# Altium schematic sheet E-16 LVDS to HDMI.SchDoc: FRDM-IMX93
size 513 x 386 mm; DrawnBy: FORLINX; Organization: ORGANIZATION; Address1: ADDRESS 1; Address2: ADDRESS 2; Address3: ADDRESS 3; Address4: ADDRESS 4; Revision: -; ENG_APP_DATE: --/--/--; DSN_APP_DATE: --/--/--; CHK_APP_DATE: --/--/--; Classification: Public, Company Internal/Proprietary, Company Confidential,  Company Secret; Page Create Date: March  8, 1995; OrgName: NXP Semiconductor; FIUO: A; OrgAddr1: NO. 192 Liangjing Rd. Pudong New Area, ShangHai; Page Number: 16; PageTitle: LVDS to HDMI; Page Size: C; Page Count: 23; Designer: FORLINX; RevCode: B1; Approver: NXP SE; Doc: SCH-94611 PDF: SPF-94611; DsnPath: T:\FILES\Designs\Single Board Computers\i.MX93-FRDM\Design Files\SCH-94611_B1.DSN; SchematicName: FRDM-i.MX 93 Development Board; PageName: E-16 LVDS to HDMI; PageSize: C; TopSchematic: True
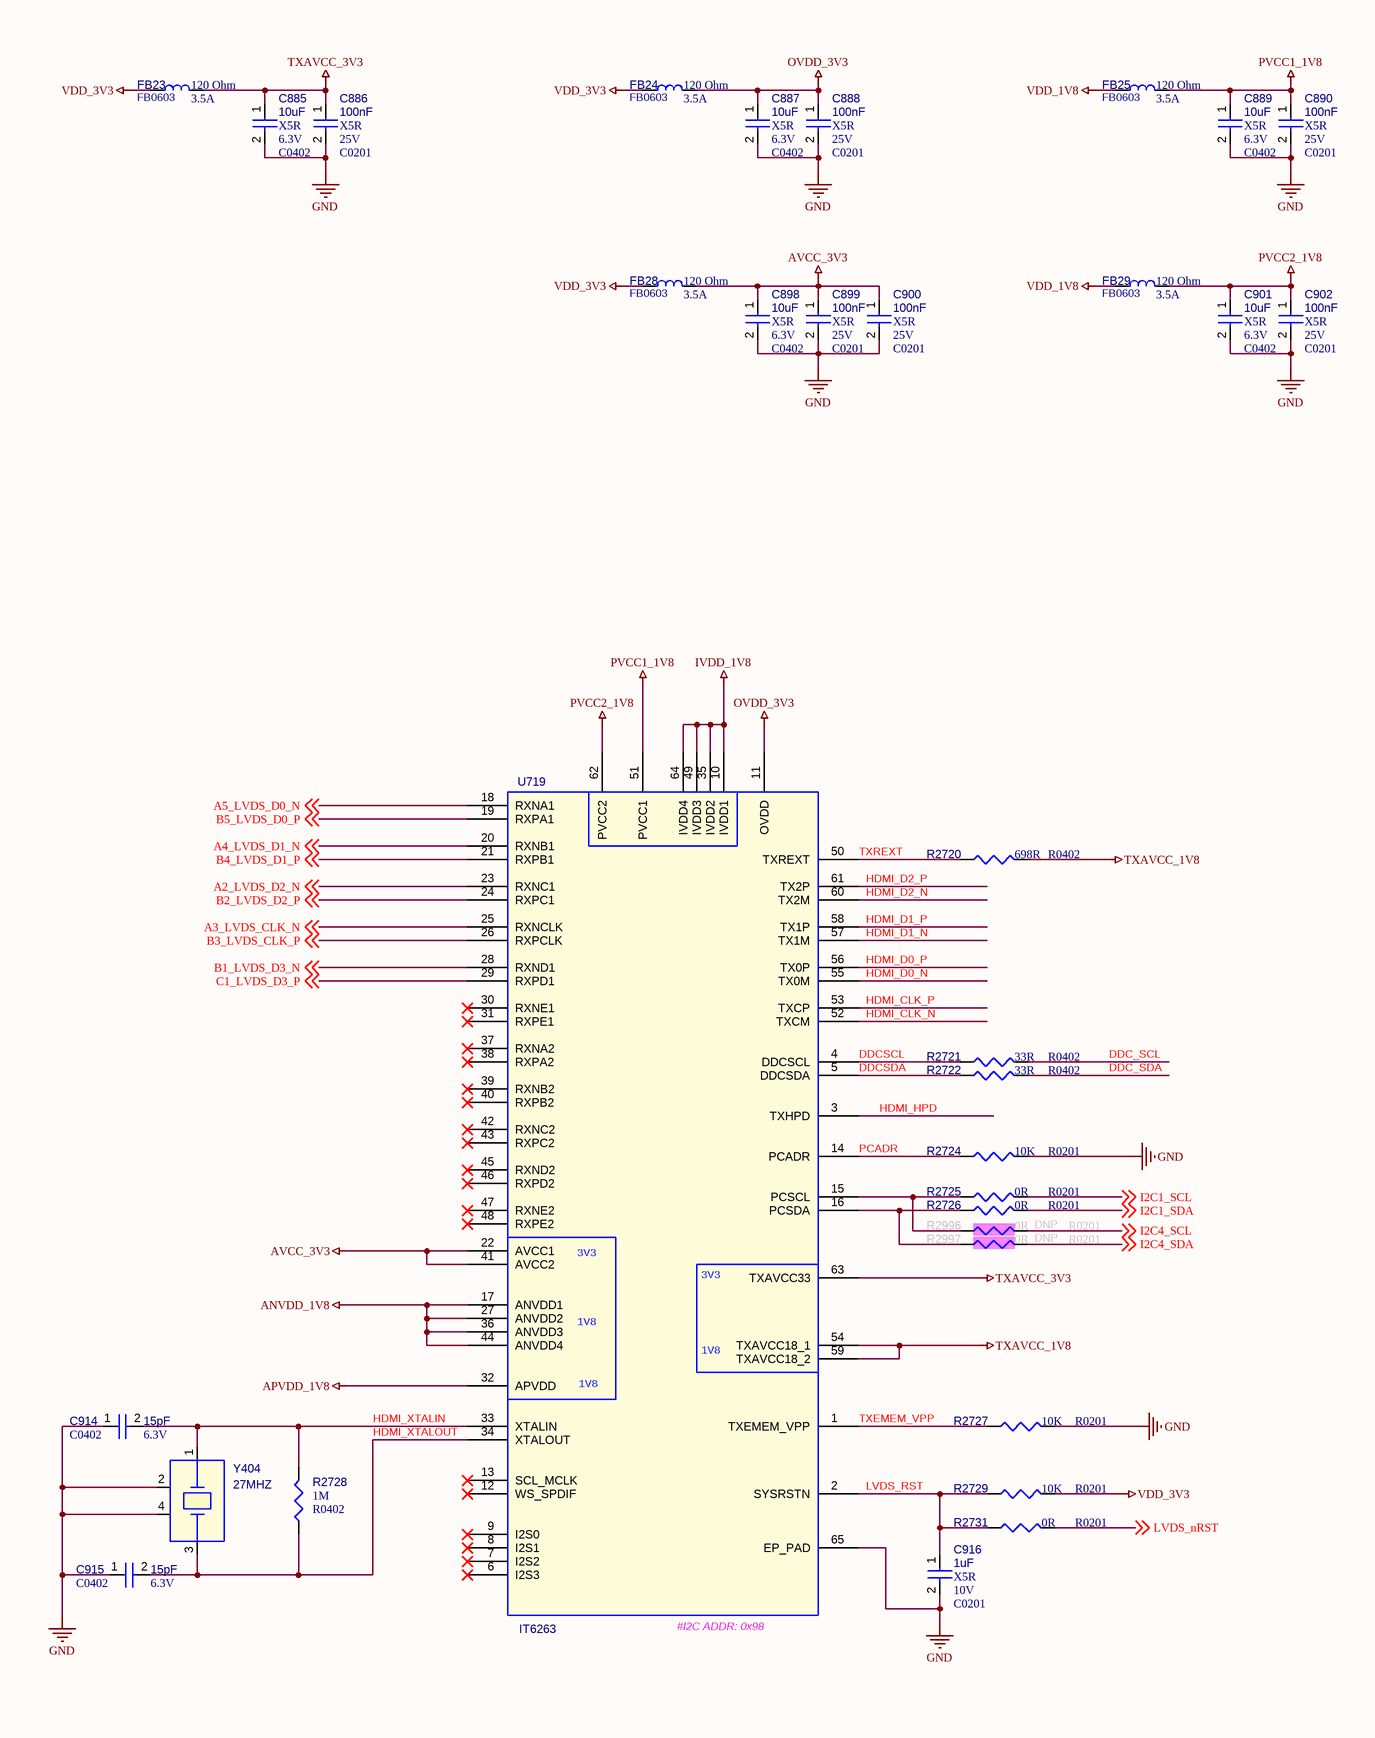
[diagram p0: E-16 LVDS to HDMI.SchDoc, left]
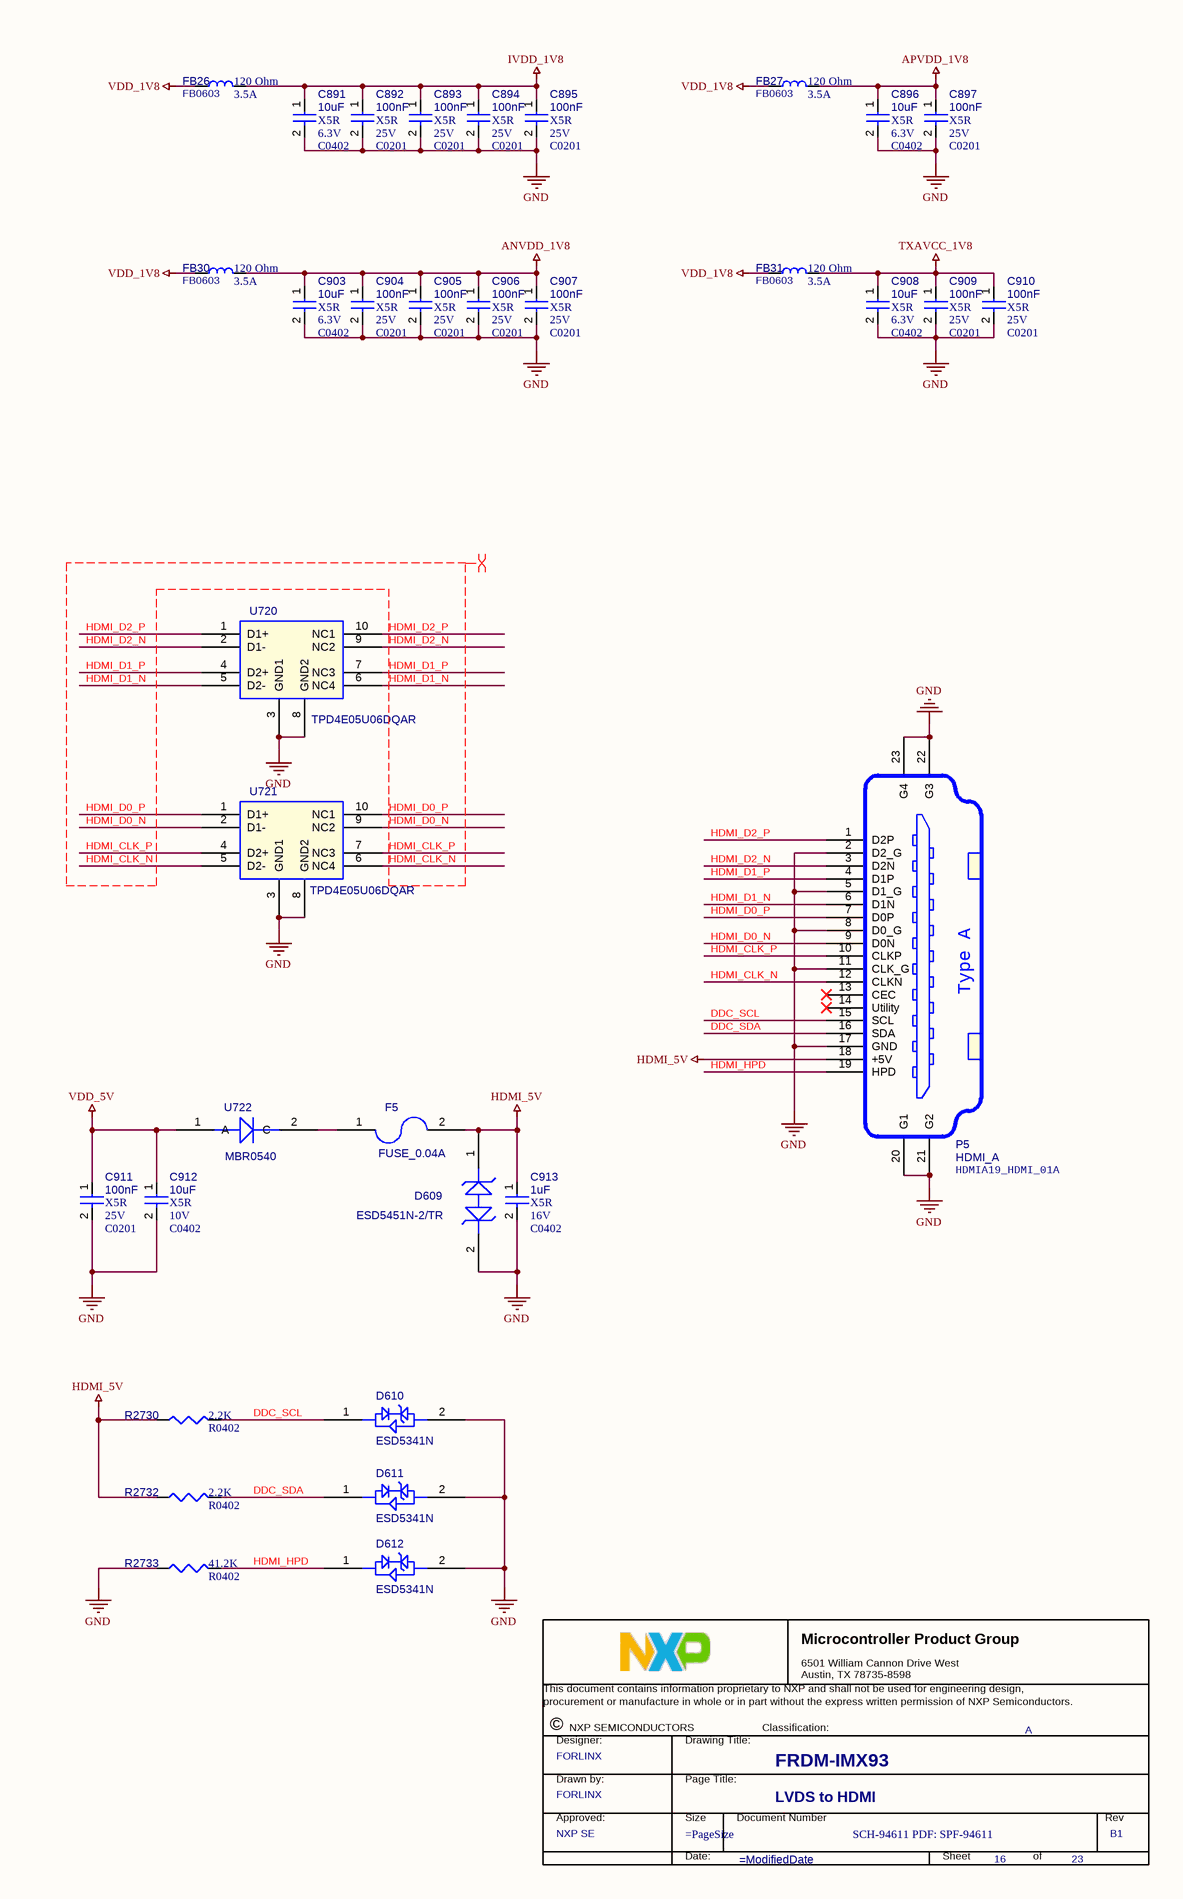
[diagram p1: E-16 LVDS to HDMI.SchDoc, right]

## Parts
*  Title: FRDM-IMX93  RevCode: B1  PageTitle: LVDS to HDMI  Page Number: 16  Page Count: 23  DrawnBy: FORLINX  Doc: SCH-94611 PDF: SPF-94611  Approver: NXP SE  FIUO: A  (graphical)
C885  10uF  Voltage: 6.3V  Dielectric: X5R  [C0402]
C886  100nF  Voltage: 25V  Dielectric: X5R  [C0201]
C887  10uF  Voltage: 6.3V  Dielectric: X5R  [C0402]
C888  100nF  Voltage: 25V  Dielectric: X5R  [C0201]
C889  10uF  Voltage: 6.3V  Dielectric: X5R  [C0402]
C890  100nF  Voltage: 25V  Dielectric: X5R  [C0201]
C891  10uF  Voltage: 6.3V  Dielectric: X5R  [C0402]
C892  100nF  Voltage: 25V  Dielectric: X5R  [C0201]
C893  100nF  Voltage: 25V  Dielectric: X5R  [C0201]
C894  100nF  Voltage: 25V  Dielectric: X5R  [C0201]
C895  100nF  Voltage: 25V  Dielectric: X5R  [C0201]
C896  10uF  Voltage: 6.3V  Dielectric: X5R  [C0402]
C897  100nF  Voltage: 25V  Dielectric: X5R  [C0201]
C898  10uF  Voltage: 6.3V  Dielectric: X5R  [C0402]
C899  100nF  Voltage: 25V  Dielectric: X5R  [C0201]
C900  100nF  Voltage: 25V  Dielectric: X5R  [C0201]
C901  10uF  Voltage: 6.3V  Dielectric: X5R  [C0402]
C902  100nF  Voltage: 25V  Dielectric: X5R  [C0201]
C903  10uF  Voltage: 6.3V  Dielectric: X5R  [C0402]
C904  100nF  Voltage: 25V  Dielectric: X5R  [C0201]
C905  100nF  Voltage: 25V  Dielectric: X5R  [C0201]
C906  100nF  Voltage: 25V  Dielectric: X5R  [C0201]
C907  100nF  Voltage: 25V  Dielectric: X5R  [C0201]
C908  10uF  Voltage: 6.3V  Dielectric: X5R  [C0402]
C909  100nF  Voltage: 25V  Dielectric: X5R  [C0201]
C910  100nF  Voltage: 25V  Dielectric: X5R  [C0201]
C911  100nF  Voltage: 25V  Dielectric: X5R  [C0201]
C912  10uF  Voltage: 10V  Dielectric: X5R  [C0402]
C913  1uF  Voltage: 16V  Dielectric: X5R  [C0402]
C914  15pF  Voltage: 6.3V  [C0402]
C915  15pF  Voltage: 6.3V  [C0402]
C916  1uF  Voltage: 10V  Dielectric: X5R  [C0201]
D609  ESD5451N-2/TR  [0402TVS]
D610  ESD5341N  [0402TVS]
D611  ESD5341N  [0402TVS]
D612  ESD5341N  [0402TVS]
F5  FUSE_0.04A  [F0603]
FB23  120 Ohm  electric current: 3.5A  [FB0603]
FB24  120 Ohm  electric current: 3.5A  [FB0603]
FB25  120 Ohm  electric current: 3.5A  [FB0603]
FB26  120 Ohm  electric current: 3.5A  [FB0603]
FB27  120 Ohm  electric current: 3.5A  [FB0603]
FB28  120 Ohm  electric current: 3.5A  [FB0603]
FB29  120 Ohm  electric current: 3.5A  [FB0603]
FB30  120 Ohm  electric current: 3.5A  [FB0603]
FB31  120 Ohm  electric current: 3.5A  [FB0603]
P5  HDMI_A  [HDMIA19_HDMI_01A]
R2720  698R  [R0402]
R2721  33R  [R0402]
R2722  33R  [R0402]
R2724  10K  [R0201]
R2725  0R  [R0201]
R2726  0R  [R0201]
R2727  10K  [R0201]
R2728  1M  [R0402]
R2729  10K  [R0201]
R2730  2.2K  [R0402]
R2731  0R  [R0201]
R2732  2.2K  [R0402]
R2733  41.2K  [R0402]
R2996  0R  ASSY_OPT: DNP  [R0201]
R2997  0R  ASSY_OPT: DNP  [R0201]
U719  IT6263  [qfn64_0p5_9x9_157ep]
U720  TPD4E05U06DQAR  [USON-10]
U721  TPD4E05U06DQAR  [USON-10]
U722  MBR0540  [SOD_123]
Y404  27MHZ  [xtlosc4_3p2x2p5mm_sm]

## Nets
ANVDD_1V8: C903.1 C904.1 C905.1 C906.1 C907.1 FB30.2 U719.17(ANVDD1) U719.27(ANVDD2) U719.36(ANVDD3) U719.44(ANVDD4)
APVDD_1V8: C896.1 C897.1 FB27.2 U719.32(APVDD)
AVCC_3V3: C898.1 C899.1 C900.1 FB28.2 U719.22(AVCC1) U719.41(AVCC2)
GND: C885.2 C886.2 C887.2 C888.2 C889.2 C890.2 C891.2 C892.2 C893.2 C894.2 C895.2 C896.2 C897.2 C898.2 C899.2 C900.2 C901.2 C902.2 C903.2 C904.2 C905.2 C906.2 C907.2 C908.2 C909.2 C910.2 C911.2 C912.2 C913.2 C914.1 C915.1 C916.2 D609.2 D610.2 D611.2 D612.2 P5.2(D2_G) P5.5(D1_G) P5.8(D0_G) P5.11(CLK_G) P5.17(GND) P5.20(G1) P5.21(G2) P5.22(G3) P5.23(G4) R2724.2 R2727.2 R2733.1 U719.65(EP_PAD) U720.3(GND1) U720.8(GND2) U721.3(GND1) U721.8(GND2) Y404.2 Y404.4
HDMI_5V: C913.1 D609.1 F5.2 P5.18(+5V) R2730.1 R2732.1
IVDD_1V8: C891.1 C892.1 C893.1 C894.1 C895.1 FB26.2 U719.10(IVDD1) U719.35(IVDD2) U719.49(IVDD3) U719.64(IVDD4)
OVDD_3V3: C887.1 C888.1 FB24.2 U719.11(OVDD)
PVCC1_1V8: C889.1 C890.1 FB25.2 U719.51(PVCC1)
PVCC2_1V8: C901.1 C902.1 FB29.2 U719.62(PVCC2)
TXAVCC_1V8: C908.1 C909.1 C910.1 FB31.2 R2720.2 U719.54(TXAVCC18_1) U719.59(TXAVCC18_2)
TXAVCC_3V3: C885.1 C886.1 FB23.2 U719.63(TXAVCC33)
VDD_1V8: FB25.1 FB26.1 FB27.1 FB29.1 FB30.1 FB31.1
VDD_3V3: FB23.1 FB24.1 FB28.1 R2729.2
VDD_5V: C911.1 C912.1 U722.1(A)
A2_LVDS_D2_N: U719.23(RXNC1) ; off-sheet A2_LVDS_D2_N
A3_LVDS_CLK_N: U719.25(RXNCLK) ; off-sheet A3_LVDS_CLK_N
A4_LVDS_D1_N: U719.20(RXNB1) ; off-sheet A4_LVDS_D1_N
A5_LVDS_D0_N: U719.18(RXNA1) ; off-sheet A5_LVDS_D0_N
B1_LVDS_D3_N: U719.28(RXND1) ; off-sheet B1_LVDS_D3_N
B2_LVDS_D2_P: U719.24(RXPC1) ; off-sheet B2_LVDS_D2_P
B3_LVDS_CLK_P: U719.26(RXPCLK) ; off-sheet B3_LVDS_CLK_P
B4_LVDS_D1_P: U719.21(RXPB1) ; off-sheet B4_LVDS_D1_P
B5_LVDS_D0_P: U719.19(RXPA1) ; off-sheet B5_LVDS_D0_P
C1_LVDS_D3_P: U719.29(RXPD1) ; off-sheet C1_LVDS_D3_P
DDC_SCL: D610.1 P5.15(SCL) R2721.2 R2730.2
DDC_SDA: D611.1 P5.16(SDA) R2722.2 R2732.2
DDCSCL: R2721.1 U719.4(DDCSCL)
DDCSDA: R2722.1 U719.5(DDCSDA)
HDMI_CLK_N: P5.12(CLKN) U719.52(TXCM) U721.5(D2-) U721.6(NC4)
HDMI_CLK_P: P5.10(CLKP) U719.53(TXCP) U721.4(D2+) U721.7(NC3)
HDMI_D0_N: P5.9(D0N) U719.55(TX0M) U721.2(D1-) U721.9(NC2)
HDMI_D0_P: P5.7(D0P) U719.56(TX0P) U721.1(D1+) U721.10(NC1)
HDMI_D1_N: P5.6(D1N) U719.57(TX1M) U720.5(D2-) U720.6(NC4)
HDMI_D1_P: P5.4(D1P) U719.58(TX1P) U720.4(D2+) U720.7(NC3)
HDMI_D2_N: P5.3(D2N) U719.60(TX2M) U720.2(D1-) U720.9(NC2)
HDMI_D2_P: P5.1(D2P) U719.61(TX2P) U720.1(D1+) U720.10(NC1)
HDMI_HPD: D612.1 P5.19(HPD) R2733.2 U719.3(TXHPD)
HDMI_XTALIN: C914.2 R2728.2 U719.33(XTALIN) Y404.1
HDMI_XTALOUT: C915.2 R2728.1 U719.34(XTALOUT) Y404.3
I2C1_SCL: R2725.2 ; off-sheet I2C1_SCL
I2C1_SDA: R2726.2 ; off-sheet I2C1_SDA
I2C4_SCL: R2996.2 ; off-sheet I2C4_SCL
I2C4_SDA: R2997.2 ; off-sheet I2C4_SDA
LVDS_nRST: R2731.2 ; off-sheet LVDS_nRST
LVDS_RST: C916.1 R2729.1 R2731.1 U719.2(SYSRSTN)
PCADR: R2724.1 U719.14(PCADR)
TXEMEM_VPP: R2727.1 U719.1(TXEMEM_VPP)
TXREXT: R2720.1 U719.50(TXREXT)
NetF5_1: F5.1 U722.2(C)
NetR2725_1: R2725.1 R2996.1 U719.15(PCSCL)
NetR2726_1: R2726.1 R2997.1 U719.16(PCSDA)

Not connected (* = marked no-connect by the designer): P5 13(CEC)* 14(Utility)*; U719 6(I2S3)* 7(I2S2)* 8(I2S1)* 9(I2S0)* 12(WS_SPDIF)* 13(SCL_MCLK)* 30(RXNE1)* 31(RXPE1)* 37(RXNA2)* 38(RXPA2)* 39(RXNB2)* 40(RXPB2)* 42(RXNC2)* 43(RXPC2)* 45(RXND2)* 46(RXPD2)* 47(RXNE2)* 48(RXPE2)*

## Layout directives
differential pair: HDMI_CLK_N, HDMI_CLK_P, HDMI_D0_N, HDMI_D0_P, HDMI_D1_N, HDMI_D1_P, HDMI_D2_N, HDMI_D2_P

## Notes on the sheet
- (near U719) #I2C ADDR: 0x98
- DWG. NO.
- REV.
- SHT.
- REVISION
- DESCRIPTION
- DATE
- APPROVED
- ENG:
- APPROVALS
- quilter.ai <http://quilter.ai>
- DSN:
- CHK:
- REFERENCE DOCUMENTS
- TITLE
- PROJECT
- BOM:
- FAB DWG:
- PCB DWG:
- ASSY DWG:
- SIZE
- FILE NAME
- C
- DWG NO.
- SHEET
- OF
- REV
- (in symbol HDMI_A) Type A
- (in symbol IT6263) 3V3; 1V8
- (in symbol TitleBlock_MCPG) Microcontroller Product Group; 6501 William Cannon Drive West / Austin, TX 78735-8598; This document contains information proprietary to NXP and shall not be used for engineering design,; procurement or manufacture in whole or in part without the express written permission of NXP Semiconductors.; ©; NXP SEMICONDUCTORS; Classification:; Designer:; Drawing Title:; Drawn by:; Page Title:; Approved:; Size; Document Number; Rev; Date:; Sheet; of

## Library data of the parts
* = TitleBlock_MCPG: Classification: Public, Company Internal/Proprietary, Company Confidential,  Company Secret; OrgAddr1: NO. 192 Liangjing Rd. Pudong New Area, ShangHai; OrgName: NXP Semiconductor; Page Size: =PageSize; Page Create Date: March  8, 1995; Designer: FORLINX; Page Modify Date: =ModifiedDate
C885 = CAP NP: 0402,10uF,6.3V,+/-20%,X5R; Part Reference: C885; Manufacturer PN: 0402X104K6R3NT; Manufacturer: FH(·ç»ª); MFG_NAME01: FENGHUA; Tolerance: ¡À10%; Priority: A; RK PN: 902004347; MFG_PN01: 0402X106M6R3NT; PCB Footprint: C0402; Value: 10uF; Created by: JJJ; Part Type: Ò»°ãÓÃÆ¬×´ÌÕ´ÉµçÈÝ
C886 = CAP NP: 0201,100nF,25V,+/-10%,X5R; Part Reference: C886; Manufacturer: FH(·ç»ª); Manufacturer PN: 0402X104K6R3NT; MFG_NAME01: FENGHUA; RK PN: 902004347; Priority: A; Tolerance: ¡À10%; MFG_PN01: 0201X104K250NT; PCB Footprint: C0201; Value: 100nF; Part Type: Ò»°ãÓÃÆ¬×´ÌÕ´ÉµçÈÝ; Created by: JJJ
C887 = CAP NP: 0402,10uF,6.3V,+/-20%,X5R; Part Reference: C887; Manufacturer PN: 0402X104K6R3NT; Manufacturer: FH(·ç»ª); MFG_NAME01: FENGHUA; Tolerance: ¡À10%; Priority: A; RK PN: 902004347; MFG_PN01: 0402X106M6R3NT; PCB Footprint: C0402; Value: 10uF; Created by: JJJ; Part Type: Ò»°ãÓÃÆ¬×´ÌÕ´ÉµçÈÝ
C888 = CAP NP: 0201,100nF,25V,+/-10%,X5R; Part Reference: C888; Manufacturer: FH(·ç»ª); Manufacturer PN: 0402X104K6R3NT; MFG_NAME01: FENGHUA; RK PN: 902004347; Priority: A; Tolerance: ¡À10%; MFG_PN01: 0201X104K250NT; PCB Footprint: C0201; Value: 100nF; Part Type: Ò»°ãÓÃÆ¬×´ÌÕ´ÉµçÈÝ; Created by: JJJ
C889 = CAP NP: 0402,10uF,6.3V,+/-20%,X5R; Part Reference: C889; Manufacturer PN: 0402X104K6R3NT; Manufacturer: FH(·ç»ª); MFG_NAME01: FENGHUA; Tolerance: ¡À10%; Priority: A; RK PN: 902004347; MFG_PN01: 0402X106M6R3NT; PCB Footprint: C0402; Value: 10uF; Created by: JJJ; Part Type: Ò»°ãÓÃÆ¬×´ÌÕ´ÉµçÈÝ
C890 = CAP NP: 0201,100nF,25V,+/-10%,X5R; Part Reference: C890; Manufacturer: FH(·ç»ª); Manufacturer PN: 0402X104K6R3NT; MFG_NAME01: FENGHUA; RK PN: 902004347; Priority: A; Tolerance: ¡À10%; MFG_PN01: 0201X104K250NT; PCB Footprint: C0201; Value: 100nF; Part Type: Ò»°ãÓÃÆ¬×´ÌÕ´ÉµçÈÝ; Created by: JJJ
C891 = CAP NP: 0402,10uF,6.3V,+/-20%,X5R; Part Reference: C891; Manufacturer PN: 0402X104K6R3NT; Manufacturer: FH(·ç»ª); MFG_NAME01: FENGHUA; Tolerance: ¡À10%; Priority: A; RK PN: 902004347; MFG_PN01: 0402X106M6R3NT; PCB Footprint: C0402; Value: 10uF; Created by: JJJ; Part Type: Ò»°ãÓÃÆ¬×´ÌÕ´ÉµçÈÝ
C892 = CAP NP: 0201,100nF,25V,+/-10%,X5R; Part Reference: C892; Manufacturer: FH(·ç»ª); Manufacturer PN: 0402X104K6R3NT; MFG_NAME01: FENGHUA; RK PN: 902004347; Priority: A; Tolerance: ¡À10%; MFG_PN01: 0201X104K250NT; PCB Footprint: C0201; Value: 100nF; Part Type: Ò»°ãÓÃÆ¬×´ÌÕ´ÉµçÈÝ; Created by: JJJ
C893 = CAP NP: 0201,100nF,25V,+/-10%,X5R; Part Reference: C893; Manufacturer PN: 0402X104K6R3NT; Manufacturer: FH(·ç»ª); MFG_NAME01: FENGHUA; Tolerance: ¡À10%; Priority: A; RK PN: 902004347; MFG_PN01: 0201X104K250NT; PCB Footprint: C0201; Value: 100nF; Created by: JJJ; Part Type: Ò»°ãÓÃÆ¬×´ÌÕ´ÉµçÈÝ
C894 = CAP NP: 0201,100nF,25V,+/-10%,X5R; Part Reference: C894; Manufacturer PN: 0402X104K6R3NT; Manufacturer: FH(·ç»ª); MFG_NAME01: FENGHUA; Tolerance: ¡À10%; Priority: A; RK PN: 902004347; MFG_PN01: 0201X104K250NT; PCB Footprint: C0201; Value: 100nF; Created by: JJJ; Part Type: Ò»°ãÓÃÆ¬×´ÌÕ´ÉµçÈÝ
C895 = CAP NP: 0201,100nF,25V,+/-10%,X5R; Part Reference: C895; Manufacturer: FH(·ç»ª); Manufacturer PN: 0402X104K6R3NT; MFG_NAME01: FENGHUA; RK PN: 902004347; Priority: A; Tolerance: ¡À10%; MFG_PN01: 0201X104K250NT; PCB Footprint: C0201; Value: 100nF; Part Type: Ò»°ãÓÃÆ¬×´ÌÕ´ÉµçÈÝ; Created by: JJJ
C896 = CAP NP: 0402,10uF,6.3V,+/-20%,X5R; Part Reference: C896; Manufacturer PN: 0402X104K6R3NT; Manufacturer: FH(·ç»ª); MFG_NAME01: FENGHUA; Tolerance: ¡À10%; Priority: A; RK PN: 902004347; MFG_PN01: 0402X106M6R3NT; PCB Footprint: C0402; Value: 10uF; Created by: JJJ; Part Type: Ò»°ãÓÃÆ¬×´ÌÕ´ÉµçÈÝ
C897 = CAP NP: 0201,100nF,25V,+/-10%,X5R; Part Reference: C897; Manufacturer PN: 0402X104K6R3NT; Manufacturer: FH(·ç»ª); MFG_NAME01: FENGHUA; Tolerance: ¡À10%; Priority: A; RK PN: 902004347; MFG_PN01: 0201X104K250NT; PCB Footprint: C0201; Value: 100nF; Created by: JJJ; Part Type: Ò»°ãÓÃÆ¬×´ÌÕ´ÉµçÈÝ
C898 = CAP NP: 0402,10uF,6.3V,+/-20%,X5R; Part Reference: C898; Manufacturer: FH(·ç»ª); Manufacturer PN: 0402X104K6R3NT; MFG_NAME01: FENGHUA; RK PN: 902004347; Priority: A; Tolerance: ¡À10%; MFG_PN01: 0402X106M6R3NT; PCB Footprint: C0402; Value: 10uF; Part Type: Ò»°ãÓÃÆ¬×´ÌÕ´ÉµçÈÝ; Created by: JJJ
C899 = CAP NP: 0201,100nF,25V,+/-10%,X5R; Part Reference: C899; Manufacturer PN: 0402X104K6R3NT; Manufacturer: FH(·ç»ª); MFG_NAME01: FENGHUA; Tolerance: ¡À10%; Priority: A; RK PN: 902004347; MFG_PN01: 0201X104K250NT; PCB Footprint: C0201; Value: 100nF; Created by: JJJ; Part Type: Ò»°ãÓÃÆ¬×´ÌÕ´ÉµçÈÝ
C900 = CAP NP: 0201,100nF,25V,+/-10%,X5R; Part Reference: C900; Manufacturer PN: 0402X104K6R3NT; Manufacturer: FH(·ç»ª); MFG_NAME01: FENGHUA; Tolerance: ¡À10%; Priority: A; RK PN: 902004347; MFG_PN01: 0201X104K250NT; PCB Footprint: C0201; Value: 100nF; Created by: JJJ; Part Type: Ò»°ãÓÃÆ¬×´ÌÕ´ÉµçÈÝ
C901 = CAP NP: 0402,10uF,6.3V,+/-20%,X5R; Part Reference: C901; Manufacturer: FH(·ç»ª); Manufacturer PN: 0402X104K6R3NT; MFG_NAME01: FENGHUA; RK PN: 902004347; Priority: A; Tolerance: ¡À10%; MFG_PN01: 0402X106M6R3NT; PCB Footprint: C0402; Value: 10uF; Part Type: Ò»°ãÓÃÆ¬×´ÌÕ´ÉµçÈÝ; Created by: JJJ
C902 = CAP NP: 0201,100nF,25V,+/-10%,X5R; Part Reference: C902; Manufacturer PN: 0402X104K6R3NT; Manufacturer: FH(·ç»ª); MFG_NAME01: FENGHUA; Tolerance: ¡À10%; Priority: A; RK PN: 902004347; MFG_PN01: 0201X104K250NT; PCB Footprint: C0201; Value: 100nF; Created by: JJJ; Part Type: Ò»°ãÓÃÆ¬×´ÌÕ´ÉµçÈÝ
C903 = CAP NP: 0402,10uF,6.3V,+/-20%,X5R; Part Reference: C903; Manufacturer PN: 0402X104K6R3NT; Manufacturer: FH(·ç»ª); MFG_NAME01: FENGHUA; Tolerance: ¡À10%; Priority: A; RK PN: 902004347; MFG_PN01: 0402X106M6R3NT; PCB Footprint: C0402; Value: 10uF; Created by: JJJ; Part Type: Ò»°ãÓÃÆ¬×´ÌÕ´ÉµçÈÝ
C904 = CAP NP: 0201,100nF,25V,+/-10%,X5R; Part Reference: C904; Manufacturer: FH(·ç»ª); Manufacturer PN: 0402X104K6R3NT; MFG_NAME01: FENGHUA; RK PN: 902004347; Priority: A; Tolerance: ¡À10%; MFG_PN01: 0201X104K250NT; PCB Footprint: C0201; Value: 100nF; Part Type: Ò»°ãÓÃÆ¬×´ÌÕ´ÉµçÈÝ; Created by: JJJ
C905 = CAP NP: 0201,100nF,25V,+/-10%,X5R; Part Reference: C905; Manufacturer PN: 0402X104K6R3NT; Manufacturer: FH(·ç»ª); MFG_NAME01: FENGHUA; Tolerance: ¡À10%; Priority: A; RK PN: 902004347; MFG_PN01: 0201X104K250NT; PCB Footprint: C0201; Value: 100nF; Created by: JJJ; Part Type: Ò»°ãÓÃÆ¬×´ÌÕ´ÉµçÈÝ
C906 = CAP NP: 0201,100nF,25V,+/-10%,X5R; Part Reference: C906; Manufacturer PN: 0402X104K6R3NT; Manufacturer: FH(·ç»ª); MFG_NAME01: FENGHUA; Tolerance: ¡À10%; Priority: A; RK PN: 902004347; MFG_PN01: 0201X104K250NT; PCB Footprint: C0201; Value: 100nF; Created by: JJJ; Part Type: Ò»°ãÓÃÆ¬×´ÌÕ´ÉµçÈÝ
C907 = CAP NP: 0201,100nF,25V,+/-10%,X5R; Part Reference: C907; Manufacturer: FH(·ç»ª); Manufacturer PN: 0402X104K6R3NT; MFG_NAME01: FENGHUA; RK PN: 902004347; Priority: A; Tolerance: ¡À10%; MFG_PN01: 0201X104K250NT; PCB Footprint: C0201; Value: 100nF; Part Type: Ò»°ãÓÃÆ¬×´ÌÕ´ÉµçÈÝ; Created by: JJJ
C908 = CAP NP: 0402,10uF,6.3V,+/-20%,X5R; Part Reference: C908; Manufacturer PN: 0402X104K6R3NT; Manufacturer: FH(·ç»ª); MFG_NAME01: FENGHUA; Tolerance: ¡À10%; Priority: A; RK PN: 902004347; MFG_PN01: 0402X106M6R3NT; PCB Footprint: C0402; Value: 10uF; Created by: JJJ; Part Type: Ò»°ãÓÃÆ¬×´ÌÕ´ÉµçÈÝ
C909 = CAP NP: 0201,100nF,25V,+/-10%,X5R; Part Reference: C909; Manufacturer: FH(·ç»ª); Manufacturer PN: 0402X104K6R3NT; MFG_NAME01: FENGHUA; RK PN: 902004347; Priority: A; Tolerance: ¡À10%; MFG_PN01: 0201X104K250NT; PCB Footprint: C0201; Value: 100nF; Part Type: Ò»°ãÓÃÆ¬×´ÌÕ´ÉµçÈÝ; Created by: JJJ
C910 = CAP NP: 0201,100nF,25V,+/-10%,X5R; Part Reference: C910; Manufacturer: FH(·ç»ª); Manufacturer PN: 0402X104K6R3NT; MFG_NAME01: FENGHUA; RK PN: 902004347; Priority: A; Tolerance: ¡À10%; MFG_PN01: 0201X104K250NT; PCB Footprint: C0201; Value: 100nF; Part Type: Ò»°ãÓÃÆ¬×´ÌÕ´ÉµçÈÝ; Created by: JJJ
C911 = CAP NP: 0201,100nF,25V,+/-10%,X5R; Part Reference: C911; Manufacturer PN: 0402X104K6R3NT; Manufacturer: FH(·ç»ª); MFG_NAME01: FENGHUA; Tolerance: ¡À10%; Priority: A; RK PN: 902004347; MFG_PN01: 0201X104K250NT; PCB Footprint: C0201; Value: 100nF; Created by: JJJ; Part Type: Ò»°ãÓÃÆ¬×´ÌÕ´ÉµçÈÝ
C912 = CAP NP: 0402,10uF,6.3V,+/-20%,X5R; Part Reference: C912; Manufacturer PN: 0402X104K6R3NT; Manufacturer: FH(·ç»ª); MFG_NAME01: FENGHUA; Tolerance: ¡À10%; Priority: A; RK PN: 902004347; MFG_PN01: 0402X106M6R3NT; PCB Footprint: C0402; Value: 10uF; Created by: JJJ; Part Type: Ò»°ãÓÃÆ¬×´ÌÕ´ÉµçÈÝ
C913 = CAP NP: 0402,1uF,16V,+/-10%,X5R; Part Reference: C913; Manufacturer: FH(·ç»ª); Manufacturer PN: 0402X104K6R3NT; MFG_NAME01: SAMSUNG; RK PN: 902004347; Priority: A; Tolerance: ¡À10%; MFG_PN01: CL05A105KO5NNNC; PCB Footprint: C0402; Value: 1uF; Part Type: Ò»°ãÓÃÆ¬×´ÌÕ´ÉµçÈÝ; Created by: JJJ
C914 = CAP NP: 0402,15pF,50V,+/-5%,NPO; Part Reference: C914; Manufacturer: FH(·ç»ª); Manufacturer PN: 0402X104K6R3NT; Dielectric: X5R; MFG_NAME01: FENGHUA; RK PN: 902004347; Priority: A; Tolerance: ¡À10%; MFG_PN01: 0402B102K500NT; PCB Footprint: C0402; Value: 15pF; Part Type: Ò»°ãÓÃÆ¬×´ÌÕ´ÉµçÈÝ; Created by: JJJ
C915 = CAP NP: 0402,15pF,50V,+/-5%,NPO; Part Reference: C915; Manufacturer: FH(·ç»ª); Manufacturer PN: 0402X104K6R3NT; Dielectric: X5R; MFG_NAME01: FENGHUA; RK PN: 902004347; Priority: A; Tolerance: ¡À10%; MFG_PN01: 0402B102K500NT; PCB Footprint: C0402; Value: 15pF; Part Type: Ò»°ãÓÃÆ¬×´ÌÕ´ÉµçÈÝ; Created by: JJJ
C916 = CAP NP: 0201,1uF,10V,+/-20%,X5R; Part Reference: C916; Manufacturer PN: 0402X104K6R3NT; Manufacturer: FH(·ç»ª); MFG_NAME01: SAMSUNG; Tolerance: ¡À10%; Priority: A; RK PN: 902004347; MFG_PN01: CL03A105MP3NSNC; PCB Footprint: C0201; Value: 1uF; Created by: JJJ; Part Type: Ò»°ãÓÃÆ¬×´ÌÕ´ÉµçÈÝ
D609 = ESD5451N-2/TR: Part Reference: D609; MFG_NAME01: WILLSEMI; Value: ESD5451N-2/TR; MFG_PN01: ESD5451N-2/TR; PCB Footprint: 0402TVS
D610 = ESD5341N: ESD5341N-2/TR; Part Reference: D610; MFG_NAME01: WILLSEMI; Value: ESD5341N; MFG_PN01: ESD5341N-2/TR; PCB Footprint: 0402TVS
D611 = ESD5341N: ESD5341N-2/TR; Part Reference: D611; MFG_NAME01: WILLSEMI; Value: ESD5341N; MFG_PN01: ESD5341N-2/TR; PCB Footprint: 0402TVS
D612 = ESD5341N: ESD5341N-2/TR; Part Reference: D612; MFG_NAME01: WILLSEMI; Value: ESD5341N; MFG_PN01: ESD5341N-2/TR; PCB Footprint: 0402TVS
F5 = FUSE_0.5A: 0603,0.04A/0.12A,15V,ASMD0603-004; Part Reference: F5; MFG_NAME01: SAMSUNG; MFG_PN01: CL05A225KP5NSNC; Value: FUSE_0.04A; PCB Footprint: F0603
FB23 = FB0402,120ohm,1.3A: 0603,120Ohm@100MHZ,3A; Part Reference: FB23; serial number: 1110304038; MFG_PN01: UPZ1608E121-3R0TF; MFG_NAME01: Sunlord; PCB Footprint: FB0603; Value: 120 Ohm
FB24 = FB0402,120ohm,1.3A: 0603,120Ohm@100MHZ,3A; Part Reference: FB24; serial number: 1110304038; MFG_PN01: UPZ1608E121-3R0TF; MFG_NAME01: Sunlord; PCB Footprint: FB0603; Value: 120 Ohm
FB25 = FB0402,120ohm,1.3A: 0603,120Ohm@100MHZ,3A; Part Reference: FB25; serial number: 1110304038; MFG_PN01: UPZ1608E121-3R0TF; MFG_NAME01: Sunlord; PCB Footprint: FB0603; Value: 120 Ohm
FB26 = FB0402,120ohm,1.3A: 0603,120Ohm@100MHZ,3A; Part Reference: FB26; serial number: 1110304038; MFG_PN01: UPZ1608E121-3R0TF; MFG_NAME01: Sunlord; PCB Footprint: FB0603; Value: 120 Ohm
FB27 = FB0402,120ohm,1.3A: 0603,120Ohm@100MHZ,3A; Part Reference: FB27; serial number: 1110304038; MFG_PN01: UPZ1608E121-3R0TF; MFG_NAME01: Sunlord; PCB Footprint: FB0603; Value: 120 Ohm
FB28 = FB0402,120ohm,1.3A: 0603,120Ohm@100MHZ,3A; Part Reference: FB28; serial number: 1110304038; MFG_PN01: UPZ1608E121-3R0TF; MFG_NAME01: Sunlord; PCB Footprint: FB0603; Value: 120 Ohm
FB29 = FB0402,120ohm,1.3A: 0603,120Ohm@100MHZ,3A; Part Reference: FB29; serial number: 1110304038; MFG_NAME01: Sunlord; MFG_PN01: UPZ1608E121-3R0TF; PCB Footprint: FB0603; Value: 120 Ohm
FB30 = FB0402,120ohm,1.3A: 0603,120Ohm@100MHZ,3A; Part Reference: FB30; serial number: 1110304038; MFG_NAME01: Sunlord; MFG_PN01: UPZ1608E121-3R0TF; PCB Footprint: FB0603; Value: 120 Ohm
FB31 = FB0402,120ohm,1.3A: 0603,120Ohm@100MHZ,3A; Part Reference: FB31; serial number: 1110304038; MFG_PN01: UPZ1608E121-3R0TF; MFG_NAME01: Sunlord; PCB Footprint: FB0603; Value: 120 Ohm
P5 = HDMI_A: HDMI-A; Part Reference: P5; Manufacturer: Íú¿Æ´ï; Manufacturer Part Number: HDMI_01A; MFG_NAME01: ANUOCONN; RK PN: 908,000,005; Priority: A; Value: HDMI_A; Part Type: HDMI Jack; Created by: JJJ; MFG_PN01: HDMI-A; PCB Footprint: HDMIA19_HDMI_01A
R2720 = R0402,4.7K_Dup1: 0402,698Ohm,+/-1%; Part Reference: R2720; precision: ¡À1£¥; serial number: 1110102015; MFG_NAME01: FENGHUA; MFG_PN01: RC-02K6980FT; PCB Footprint: R0402; Value: 698R
R2721 = R0402,4.7K_Dup1: 0402,33Ohm,+/-1%; Part Reference: R2721; precision: ¡À1£¥; serial number: 1110102015; MFG_NAME01: FENGHUA; MFG_PN01: RC-02K33R0FT; PCB Footprint: R0402; Value: 33R
R2722 = R0402,4.7K_Dup1: 0402,33Ohm,+/-1%; Part Reference: R2722; precision: ¡À1£¥; serial number: 1110102015; MFG_NAME01: FENGHUA; MFG_PN01: RC-02K33R0FT; PCB Footprint: R0402; Value: 33R
R2724 = R0402,4.7K_Dup1: 0201,10K,+/-5%; Part Reference: R2724; precision: ¡À1£¥; serial number: 1110102015; MFG_NAME01: FENGHUA; MFG_PN01: RC-01W103JT; PCB Footprint: R0201; Value: 10K
R2725 = R0402,4.7K_Dup1: 0201,0Ohm,+/-5%; Part Reference: R2725; precision: ¡À1£¥; serial number: 1110102015; MFG_NAME01: FENGHUA; MFG_PN01: RC-01000JT; PCB Footprint: R0201; Value: 0R
R2726 = R0402,4.7K_Dup1: 0201,0Ohm,+/-5%; Part Reference: R2726; precision: ¡À1£¥; serial number: 1110102015; MFG_NAME01: FENGHUA; MFG_PN01: RC-01000JT; PCB Footprint: R0201; Value: 0R
R2727 = R0402,4.7K_Dup1: 0201,10K,+/-5%; Part Reference: R2727; precision: ¡À1£¥; serial number: 1110102015; MFG_NAME01: FENGHUA; MFG_PN01: RC-01W103JT; PCB Footprint: R0201; Value: 10K
R2728 = R0402,4.7K_Dup1: 0402,1M,+/-1%; Part Reference: R2728; precision: ¡À1£¥; serial number: 1110102015; MFG_NAME01: FENGHUA; MFG_PN01: RC-02K1004FT; PCB Footprint: R0402; Value: 1M
R2729 = R0402,4.7K_Dup1: 0201,10K,+/-5%; Part Reference: R2729; precision: ¡À1£¥; serial number: 1110102015; MFG_NAME01: FENGHUA; MFG_PN01: RC-01W103JT; PCB Footprint: R0201; Value: 10K
R2730 = R0402,4.7K_Dup1: 0402,2.2K,+/-1%; Part Reference: R2730; precision: ¡À1£¥; serial number: 1110102015; MFG_NAME01: FENGHUA; MFG_PN01: RC-02K2201FT; PCB Footprint: R0402; Value: 2.2K
R2731 = R0402,4.7K_Dup1: 0201,0Ohm,+/-5%; Part Reference: R2731; precision: ¡À1£¥; serial number: 1110102015; MFG_NAME01: FENGHUA; MFG_PN01: RC-01000JT; PCB Footprint: R0201; Value: 0R
R2732 = R0402,4.7K_Dup1: 0402,2.2K,+/-1%; Part Reference: R2732; precision: ¡À1£¥; serial number: 1110102015; MFG_NAME01: FENGHUA; MFG_PN01: RC-02K2201FT; PCB Footprint: R0402; Value: 2.2K
R2733 = R0402,4.7K_Dup1: 0402,41.2K,+/-1%; Part Reference: R2733; precision: ¡À1£¥; serial number: 1110102015; MFG_NAME01: FENGHUA; MFG_PN01: RC-02W4122FT; PCB Footprint: R0402; Value: 41.2K
R2996 = R0402,4.7K_Dup1: 0201,0Ohm,+/-5%; Part Reference: R2996; precision: ¡À1£¥; serial number: 1110102015; MFG_NAME01: FENGHUA; MFG_PN01: RC-01000JT; PCB Footprint: R0201; Value: 0R
R2997 = R0402,4.7K_Dup1: 0201,0Ohm,+/-5%; Part Reference: R2997; precision: ¡À1£¥; serial number: 1110102015; MFG_NAME01: FENGHUA; MFG_PN01: RC-01000JT; PCB Footprint: R0201; Value: 0R
U719 = IT6263: IT6263FN,QFN64,9*9mm,LVDS to HDMI; Part Reference: U719; MFG_NAME01: ITE; Value: IT6263; MFG_PN01: IT6263FN; PCB Footprint: qfn64_0p5_9x9_157ep
U720 = TPD4E05U06DQAR_10: TPD4E05U06DQAR,USON; Part Reference: U720; MFG_NAME01: TI; Value: TPD4E05U06DQAR; MFG_PN01: TPD4E05U06DQAR; PCB Footprint: USON-10
U721 = TPD4E05U06DQAR_5: TPD4E05U06DQAR,USON; Part Reference: U721; MFG_NAME01: TI; Value: TPD4E05U06DQAR; MFG_PN01: TPD4E05U06DQAR; PCB Footprint: USON-10
U722 = MBR0540_0: MBR0540,SOD123; Part Reference: U722; MFG_NAME01: Cystek; Value: MBR0540; MFG_PN01: MBR0540; PCB Footprint: SOD_123
Y404 = XTAL_13: Crystal,27MHZ,4P,3.2*2.5mm,+/-20ppm,20pf; Part Reference: Y404; CLASS: IC; MFG_NAME01: SCTF; MFG_PN01: SX5B27.000F2020F30; CAD_APPROVED: Yes; Value: 27MHZ; ROHS: Yes; HEIGHT: 0.60MM; PCB Footprint: xtlosc4_3p2x2p5mm_sm